# EAGLE design SBDBT (EAGLE 7.2.0)
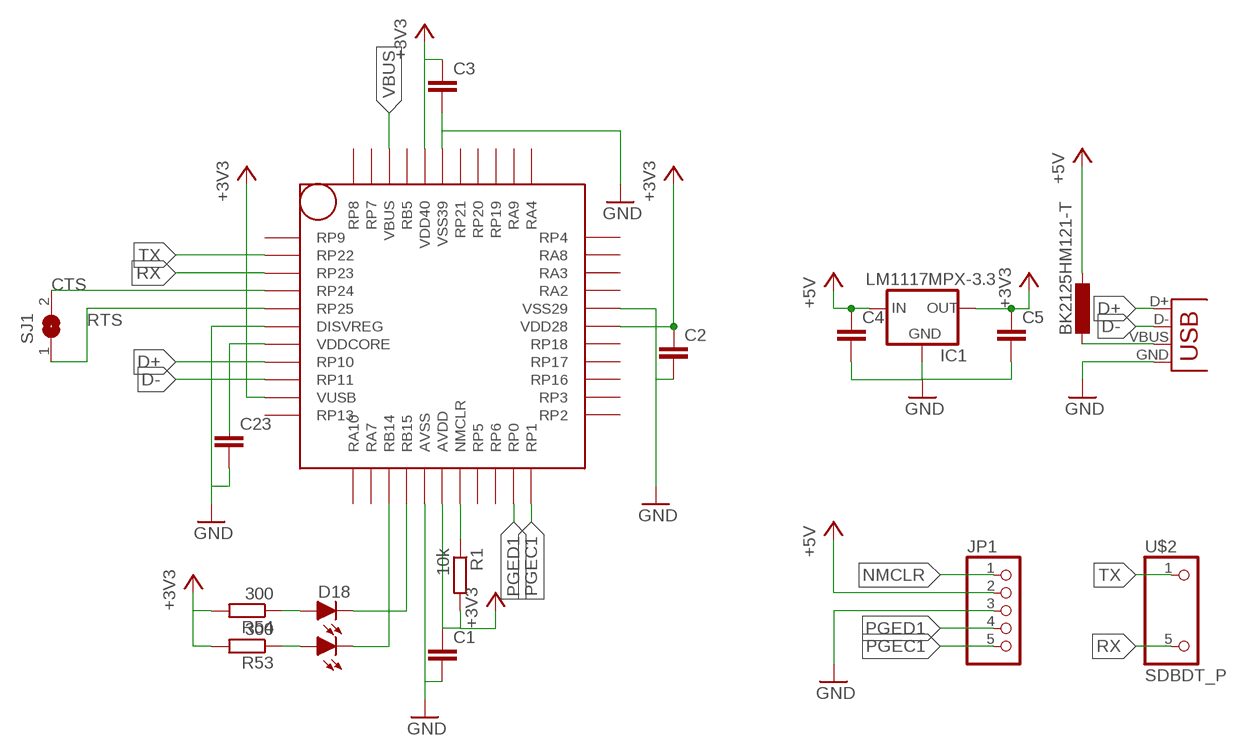
[diagram p0: schematic, sheet 1]

## Parts
BK2125HM121-T  L-EUL2012C  [L2012C]
C1  C-EUC0603K  [C0603K]
C2  C-EUC0603K  [C0603K]
C3  C-EUC0603K  [C0603K]
C4  C-EUC0603K  [C0603K]
C5  C-EUC0603K  [C0603K]
C23  C-EUC0603K  [C0603K]
D18  SEC2XX4  [LED3025]
IC1  LM1117MPX-3.3  LM1117  [SOT223]
JP1  PINHD-1X5  [1X05]
R1  10k  R-EU_R0603  [R0603]
R53  300  R-EU_R0603  [R0603]
R54  300  R-EU_R0603  [R0603]
SJ1  SJ  [SJ]
U$1  PIC24FJ64GB004  [SQFP-S-10X10-44]
U$2  SDBDT_P  [SDBDT_P]
X2  USB_  [USB-A-S-SILK-FEMALE]

## Nets
+3V3: C1.1 C2.1 C3.1 C5.1 IC1.2(OUT1) IC1.4(OUT) R1.2 R53.2 R54.2 U$1.AVDD U$1.VDD28 U$1.VDD40 U$1.VUSB
+5V: BK2125HM121-T.1 C4.1 IC1.3(IN) JP1.2
CTS: SJ1.2 U$1.RP24
D+: U$1.RP10 X2.D+
D-: U$1.RP11 X2.D-
GND: C1.2 C2.2 C3.2 C4.2 C5.2 C23.2 IC1.1(GND) JP1.3 U$1.AVSS U$1.DISVREG U$1.VSS29 U$1.VSS39 X2.GND
N$1: D18.2(C1) U$1.RB14
N$2: D18.1(C0) U$1.RB15
N$5: C23.1 U$1.VDDCORE
N$37: D18.3(A1) R53.1
N$58: D18.4(A0) R54.1
NMCLR: JP1.1 R1.1 U$1.NMCLR
PGEC1: JP1.5 U$1.RP1
PGED1: JP1.4 U$1.RP0
RTS: SJ1.1 U$1.RP25
RX: U$1.RP23 U$2.5
TX: U$1.RP22 U$2.1
VBUS: BK2125HM121-T.2 U$1.VBUS X2.VBUS
Unconnected: U$1.RA2 U$1.RA3 U$1.RA4 U$1.RA7 U$1.RA8 U$1.RA9 U$1.RA10 U$1.RB5 U$1.RP2 U$1.RP3 U$1.RP4 U$1.RP5 U$1.RP6 U$1.RP7 U$1.RP8 U$1.RP9 U$1.RP13 U$1.RP16 U$1.RP17 U$1.RP18 U$1.RP19 U$1.RP20 U$1.RP21

## Library data of the parts
BK2125HM121-T = resistor:L-EU: INDUCTOR, European symbol
C1-C5 C23 = resistor:C-EU: CAPACITOR, European symbol
D18 = SRT162-010:SEC2XX4
IC1 = VoltageRegulator:LM1117
JP1 = pinhead:PINHD-1X5: PIN HEADER
R1 R53 R54 = resistor:R-EU_: RESISTOR, European symbol
SJ1 = jumper:SJ: SMD solder JUMPER
U$1 = micro-cyrod:PIC24FJ64GB004
U$2 = pinhead:SDBDT_P
X2 = SparkFun:USB: USB Connectors USB-B-PTH is fully proven SKU : PRT-00139 USB-miniB is fully proven SKU : PRT-00587 USB-A-PCB is untested. USB-A-H is throughly reviewed, but untested. Spark Fun Electronics SKU : PRT-00437 USB-B-SMT is throughly reviewed, but untested. Needs silkscreen touching up. USB-A-S has not been used/tested USB-MB-H has not been used/tested

## Board
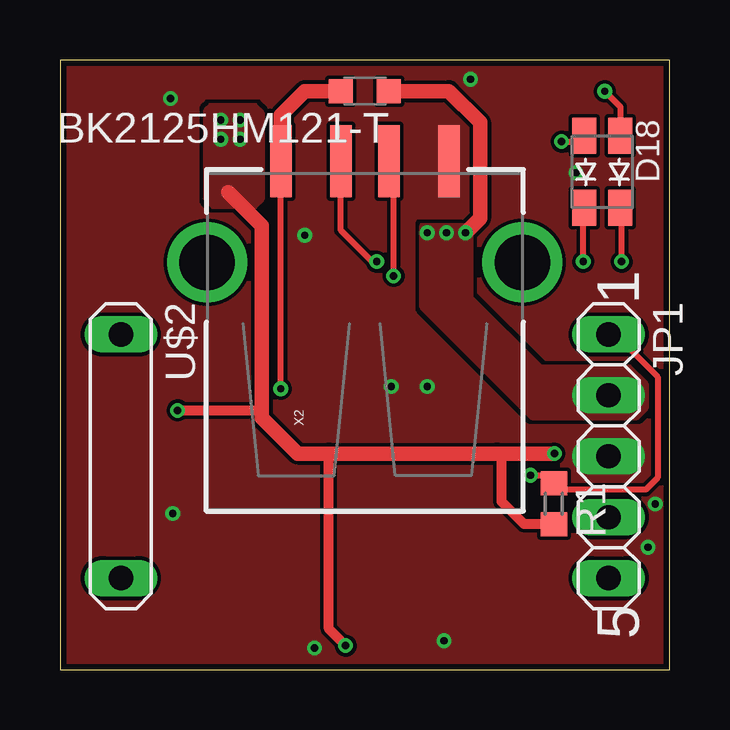
[diagram p1: board, top side]
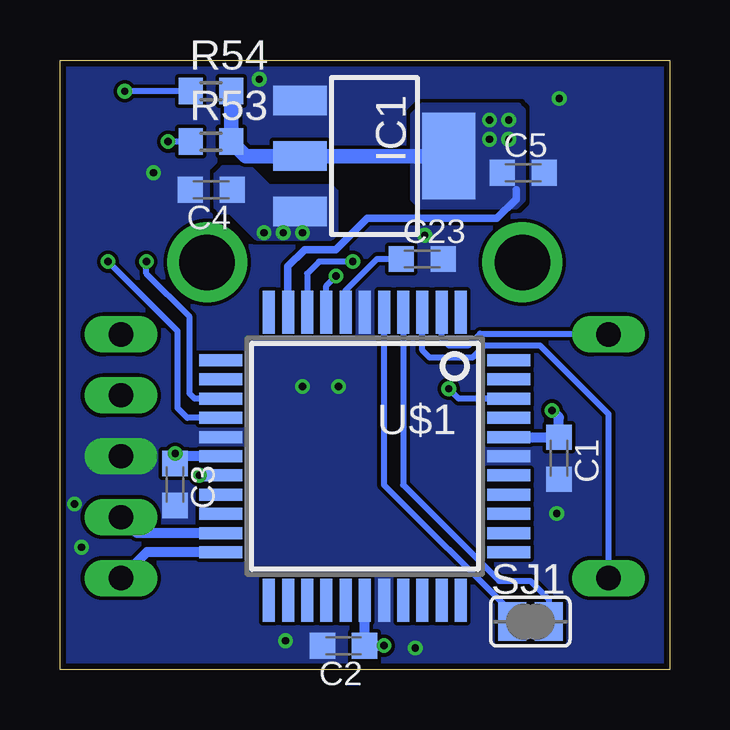
[diagram p2: board, bottom side, seen from below]

Size 25.4 x 25.4 mm. Coordinates in mm from the lower left corner, seen from the top.
Outline: 0,0 25.4,0 25.4,25.4 0,25.4 0,0
Copper layers (1*16): Top 0.035mm / dielectric 1.5mm / Bottom 0.035mm
Design rules "default *": minimum track width 6mil, minimum drill 12mil, track to track 6mil, track to pad 6mil, pad to pad 6mil, via to via 6mil, smd to smd 0mil, copper to edge 10mil, drill to drill 10mil, minimum pad ring 10mil, minimum via ring 6mil, stop-mask expansion 2mil, vias tented up to drill 0mil, thermal gap 10mil

### Footprints (pad centres in the part's own frame; a part is rotated, then mirrored left to right if it is on the bottom)
L2012C = smd 1 x 1: 1 -1,0; 2 1,0
C0603K = smd 1.05 x 1.08: 1 -0.875,0; 2 0.875,0
LED3025 = smd 1.5 x 1: 1 1.5,0.75; 2 1.5,-0.75; 3 -1.5,-0.75; 4 -1.5,0.75
SOT223 = smd 1.219 x 2.235: 1 -2.311,-3.099; 2 0,-3.099; 3 2.311,-3.099 | smd 3.6 x 2.2: 4 0,3.099
1X05 = drill 1.016 long: 1 -5.08,0; 2 -2.54,0; 3 0,0; 4 2.54,0; 5 5.08,0
R0603 = smd 1 x 1.1: 1 -0.85,0; 2 0.85,0
SJ = smd 1.168 x 1.6: 1 -0.762,0; 2 0.762,0
SQFP-S-10X10-44 = smd 1.8 x 0.5: AVDD 6,0; AVSS 6,-0.8; NMCLR 6,0.8; RA4 -6,4; RA7 6,-3.2; RA9 -6,3.2; RA10 6,-4; RB5 -6,-1.6; RB14 6,-2.4; RB15 6,-1.6; RP0 6,3.2; RP1 6,4; RP5 6,1.6; RP6 6,2.4; RP7 -6,-3.2; RP8 -6,-4; RP19 -6,2.4; RP20 -6,1.6; RP21 -6,0.8; VBUS -6,-2.4; VDD40 -6,-0.8; VSS39 -6,0 | smd 0.5 x 1.8: DISVREG 0,-6; RA2 -1.6,6; RA3 -2.4,6; RA8 -3.2,6; RP2 4,6; RP3 3.2,6; RP4 -4,6; RP9 -4,-6; RP10 1.6,-6; RP11 2.4,-6; RP13 4,-6; RP16 2.4,6; RP17 1.6,6; RP18 0.8,6; RP22 -3.2,-6; RP23 -2.4,-6; RP24 -1.6,-6; RP25 -0.8,-6; VDD28 0,6; VDDCORE 0.8,-6; VSS29 -0.8,6; VUSB 3.2,-6
SDBDT_P = drill 1.016 long: 1 -5.08,2.54; 5 5.08,2.54
USB-A-S-SILK-FEMALE = smd 3 x 0.9: D+ 7.212,-1; D- 7.212,1; GND 7.212,-3.5; VBUS 7.212,3.5 | drill 2.311: P$5 3,-6.566; P$6 3,6.566

### Placement (x,y rotation side)
BK2125HM121-T  12.7,24.1 180 top
C1  4.61,8.81 270 bottom
C2  13.59,1 180 bottom
C3  20.61,7.71 270 bottom
C4  19.1,20 180 bottom
C5  6.1,20.7 0 bottom
C23  10.31,17.11 0 bottom
D18  22.6,20.74 270 top
IC1  12.3,21.4 270 bottom
JP1  22.86,8.89 270 top
R1  20.58,6.91 270 top
R53  19.11,22 0 bottom
R54  19.11,24.1 0 bottom
SJ1  5.8,2 0 bottom
U$1  12.7,8.89 180 bottom
U$2  0,8.89 270 top
X2  12.7,13.97 90 top

### Tracks (layer width: path | path; a pad name or v marks a point on that pad's centre or on a via)
+3V3  (via drill 0.3)
  Top 0.406: v4.9,10.8 8.4,10.8 | v11.9,1 11.2,1.7 11.2,9 | R1.2 19.34,6.06 18.4,7 18.4,8.8 18.2,9
  Top 0.61: 7,19.9 8.4,18.5 8.4,10.8 8.4,10.5 9.9,9 11.2,9 18.2,9 v20.6,9
  Bottom 0.305: U$1.VUSB 15.9,16.8 15.2,17.5 13.9,17.5 12.6,18.8 7.2,18.8 6.4,19.6 6.4,20
  Bottom 0.406: U$1.VDD40 C1.1 4.61,10.51 v4.9,10.8 | v11.9,1 C2.1 12.7,1.01 U$1.VDD28 | v20.6,9 v20.61,8.99 C3.1 20.3,8.89 U$1.AVDD
  Bottom 0.61: R54.2 R53.2 17.66,21.4 IC1.2 IC1.4
  other vias: 6.7,22.9 6.7,22.1 7.5,22.9 7.5,22.1
  pour Bottom (no thermals): 6.3,23.5 10.3,23.5 10.7,23.1 10.7,19.6 10.4,19.3 6.4,19.3 6.1,19.6 6.1,23.3
  pour Top (no thermals): 6.3,23.5 8.1,23.5 8.4,23.2 8.4,19.6 8.1,19.3 6.4,19.3 6.1,19.6 6.1,23.3
+5V  (via drill 0.3)
  Top 0.61: BK2125HM121-T.1 16.2,24.1 17.5,22.8 17.5,18.8 v16.9,18.2
  other vias: 15.3,18.2 16.1,18.2
  pour Top (no thermals): 15.1,18.5 17.1,18.5 17.1,15.5 20,12.6 23.7,12.6 24.4,11.9 24.4,10.9 24,10.5 19.7,10.5 15.1,15.1
  pour Bottom (no thermals): 14.1,20.1 16.7,20.1 17.5,20.9 18.6,20.9 18.9,20.6 18.9,19.3 18.7,19.1 18.3,19.1 17.2,18 14.1,18 13.9,18.2 13.9,19.9
CTS
  Bottom 0.254: U$1.RP24 11.1,7.7 7.1,3.7 5.8,3.7 5.04,2.94 SJ1.2
D+  (via drill 0.3)
  Top 0.254: v13.9,16.4 13.9,20.98 X2.D+
  Bottom 0.254: U$1.RP10 14.3,16 v13.9,16.4
D-  (via drill 0.3)
  Top 0.254: X2.D- 11.7,18.3 13,17 v13.2,17
  Bottom 0.254: v13.2,17 14.6,17 15.1,16.5 U$1.RP11
GND  (via drill 0.3)
  other vias: 17.1,24.6 24.8,6.9 24.5,5.1 16,1.2 10.6,0.9 4.7,6.5 4.6,23.8 10.2,18.1 21.5,20.7 15.3,11.8 13.8,11.8
  pour Top (rank 6, no thermals): -2.1,27.3 28.1,27.3 28.1,-2.1 -2.1,-2.1
  pour Bottom (rank 6, no thermals): -1.7,26.9 27.1,26.9 27.1,-1.2 -1.7,-1.2
N$1  (via drill 0.3)
  Top 0.254: v21.8,17 21.8,19.19 D18.2
  Bottom 0.254: U$1.RB14 19.79,11.29 20,11.5 20,14.7 21.8,16.5 v21.8,17
N$2  (via drill 0.3)
  Top 0.254: v23.4,17 23.4,19.19 D18.1
  Bottom 0.254: U$1.RB15 20.09,10.49 20.5,10.9 20.5,14.1 v23.4,17
N$5
  Bottom 0.254: U$1.VDDCORE 13.5,15.8 12.19,17.11 C23.1
N$37  (via drill 0.3)
  Top 0.254: v20.9,22 21.61,22 D18.3
  Bottom 0.254: R53.1 v20.9,22
N$58  (via drill 0.3)
  Top 0.254: v22.7,24.1 23.35,23.45 D18.4
  Bottom 0.254: R54.1 v22.7,24.1
NMCLR  (via drill 0.3)
  Top 0.254: JP1.1 23.13,13.97 24.9,12.2 24.9,8 24.4,7.5 20.84,7.5 R1.1 20.24,8.1 v19.6,8.1
  Bottom 0.254: U$1.NMCLR v19.6,8.1
PGEC1
  Bottom 0.406: U$1.RP1 21.78,4.89 JP1.5
PGED1
  Bottom 0.406: U$1.RP0 22.2,5.69 JP1.4
RTS
  Bottom 0.254: U$1.RP25 11.9,7.7 6.56,2.36 SJ1.1
RX
  Bottom 0.254: U$2.5 2.54,10.64 5.4,13.5 7.72,13.5 8.22,13 10,13 10.3,13.3 U$1.RP23
TX
  Bottom 0.254: U$1.RP22 9.5,13.8 9.2,13.5 8.4,13.5 7.9,14 2.57,14 U$2.1
VBUS  (via drill 0.3)
  Top 0.254: v9.2,11.7 X2.VBUS
  Top 0.61: BK2125HM121-T.2 10.2,24.1 9.2,23.1 X2.VBUS
  Bottom 0.254: U$1.VBUS 8.79,11.29 v9.2,11.7

### Text on the board
tPlace: 1 | 5